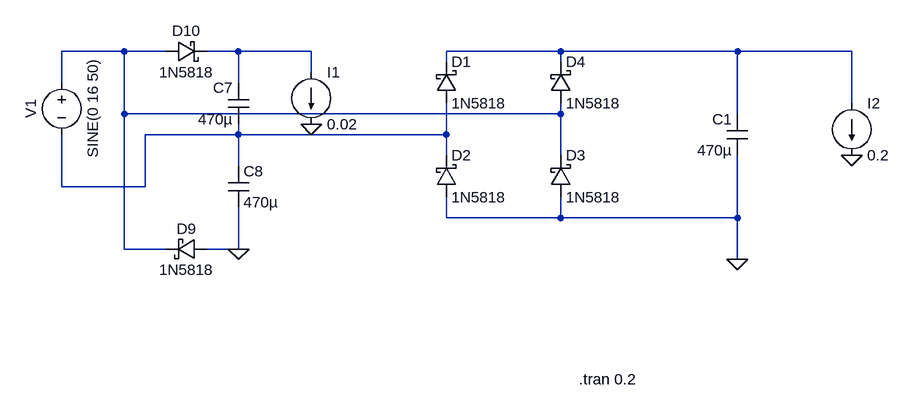
[diagram p0: schematic voltage_doubler_troubleshoot_reverse_voltage.asc]
voltage_doubler_troubleshoot_reverse_voltage.asc, the LTspice schematic file:
Version 4
SHEET 1 944 724
WIRE -480 -48 -576 -48
WIRE -416 -48 -480 -48
WIRE -304 -48 -352 -48
WIRE -192 -48 -304 -48
WIRE 192 -48 16 -48
WIRE 464 -48 192 -48
WIRE 640 -48 464 -48
WIRE 16 -32 16 -48
WIRE 192 -32 192 -48
WIRE -192 -16 -192 -48
WIRE -576 0 -576 -48
WIRE -304 0 -304 -48
WIRE 640 32 640 -48
WIRE -480 48 -480 -48
WIRE 192 48 192 32
WIRE 192 48 -480 48
WIRE 464 48 464 -48
WIRE -304 80 -304 64
WIRE -304 80 -448 80
WIRE 16 80 16 32
WIRE 16 80 -304 80
WIRE 16 112 16 80
WIRE 192 112 192 48
WIRE -304 128 -304 80
WIRE -576 160 -576 80
WIRE -448 160 -448 80
WIRE -448 160 -576 160
WIRE 16 208 16 176
WIRE 192 208 192 176
WIRE 192 208 16 208
WIRE 464 208 464 112
WIRE 464 208 192 208
WIRE -480 256 -480 48
WIRE -416 256 -480 256
WIRE -304 256 -304 192
WIRE -304 256 -352 256
WIRE 464 272 464 208
FLAG -304 256 0
FLAG 464 272 0
FLAG -192 64 0
FLAG 640 112 0
SYMBOL voltage -576 -16 M0
WINDOW 0 32 56 VTop 2
WINDOW 3 -32 56 VBottom 2
WINDOW 123 0 0 Left 0
WINDOW 39 0 0 Left 0
SYMATTR InstName V1
SYMATTR Value SINE(0 16 50)
SYMBOL schottky -352 240 R90
WINDOW 0 0 32 VBottom 2
WINDOW 3 32 32 VTop 2
SYMATTR InstName D9
SYMATTR Value 1N5818
SYMATTR Description Diode
SYMATTR Type diode
SYMBOL schottky -416 -64 M90
WINDOW 0 0 32 VBottom 2
WINDOW 3 32 32 VTop 2
SYMATTR InstName D10
SYMATTR Value 1N5818
SYMATTR Description Diode
SYMATTR Type diode
SYMBOL cap -288 64 R180
WINDOW 0 24 56 Left 2
WINDOW 3 24 8 Left 2
SYMATTR InstName C7
SYMATTR Value 470µ
SYMATTR SpiceLine Rser=0.1
SYMBOL cap -320 128 R0
SYMATTR InstName C8
SYMATTR Value 470µ
SYMATTR SpiceLine Rser=0.1
SYMBOL schottky 0 32 M180
WINDOW 0 24 64 Left 2
WINDOW 3 24 0 Left 2
SYMATTR InstName D1
SYMATTR Value 1N5818
SYMATTR Description Diode
SYMATTR Type diode
SYMBOL schottky 0 176 M180
WINDOW 0 24 64 Left 2
WINDOW 3 24 0 Left 2
SYMATTR InstName D2
SYMATTR Value 1N5818
SYMATTR Description Diode
SYMATTR Type diode
SYMBOL schottky 176 176 M180
WINDOW 0 24 64 Left 2
WINDOW 3 24 0 Left 2
SYMATTR InstName D3
SYMATTR Value 1N5818
SYMATTR Description Diode
SYMATTR Type diode
SYMBOL schottky 176 32 M180
WINDOW 0 24 64 Left 2
WINDOW 3 24 0 Left 2
SYMATTR InstName D4
SYMATTR Value 1N5818
SYMATTR Description Diode
SYMATTR Type diode
SYMBOL cap 480 112 R180
WINDOW 0 24 56 Left 2
WINDOW 3 24 8 Left 2
SYMATTR InstName C1
SYMATTR Value 470µ
SYMATTR SpiceLine Rser=0.1
SYMBOL current -192 -16 R0
WINDOW 123 0 0 Left 0
WINDOW 39 0 0 Left 0
SYMATTR InstName I1
SYMATTR Value 0.02
SYMBOL current 640 32 R0
WINDOW 123 0 0 Left 0
WINDOW 39 0 0 Left 0
SYMATTR InstName I2
SYMATTR Value 0.2
TEXT 220 456 Left 2 !.tran 0.2

The netlist it stands for:
* voltage_doubler_troubleshoot_reverse_voltage.asc
V1 N001 N004 SINE(0 16 50)
D9 0 N001 1N5818
D10 N001 N002 1N5818
C7 N004 N002 470µ Rser=0.1
C8 N004 0 470µ Rser=0.1
D1 N004 N003 1N5818
D2 0 N004 1N5818
D3 0 N001 1N5818
D4 N001 N003 1N5818
C1 0 N003 470µ Rser=0.1
I1 N002 0 0.02
I2 N003 0 0.2
.model D D
.lib standard.dio
.tran 0.2
.backanno
.end